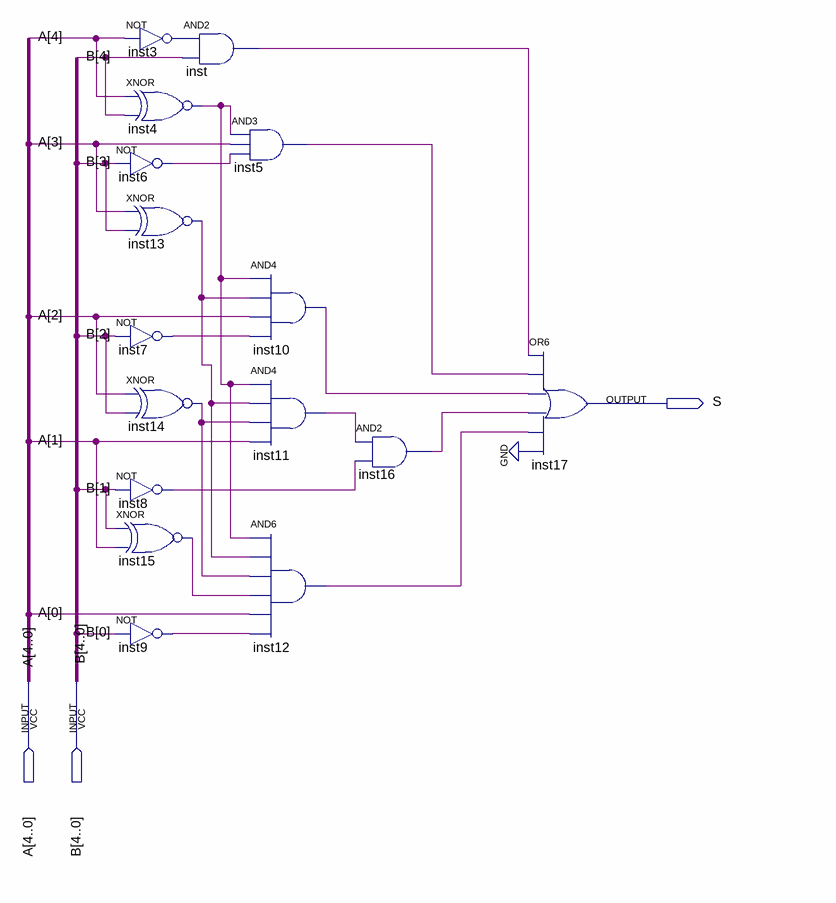
[diagram p0: schematic sheet]
// Quartus schematic Comp_bigger.bdf as structural Verilog: 16 symbols, 3 pins
module Comp_bigger (
  input  [4:0] A,
  input  [4:0] B,
  output S
);

  wire inst3_out, inst4_out, inst5_out, inst6_out, inst7_out, inst8_out, inst9_out, inst10_out, inst11_out,
       inst12_out, inst13_out, inst14_out, inst15_out, inst16_out, inst_out;

  not inst3 (inst3_out, A[4]);
  xnor inst4 (inst4_out, A[4], B[4]);
  not inst6 (inst6_out, B[3]);
  xnor inst13 (inst13_out, A[3], B[3]);
  not inst7 (inst7_out, B[2]);
  xnor inst14 (inst14_out, A[2], B[2]);
  not inst8 (inst8_out, B[1]);
  xnor inst15 (inst15_out, B[1], A[1]);
  not inst9 (inst9_out, B[0]);
  and inst (inst_out, inst3_out, B[4]);
  and inst5 (inst5_out, inst4_out, A[3], inst6_out);
  and inst10 (inst10_out, inst4_out, inst13_out, A[2], inst7_out);
  and inst11 (inst11_out, inst4_out, inst13_out, inst14_out, A[1]);
  and inst12 (inst12_out, inst4_out, inst13_out, inst14_out, inst15_out, A[0], inst9_out);
  and inst16 (inst16_out, inst11_out, inst8_out);
  or inst17 (S, inst_out, inst5_out, inst10_out, inst16_out, inst12_out, 1'b0);
endmodule
